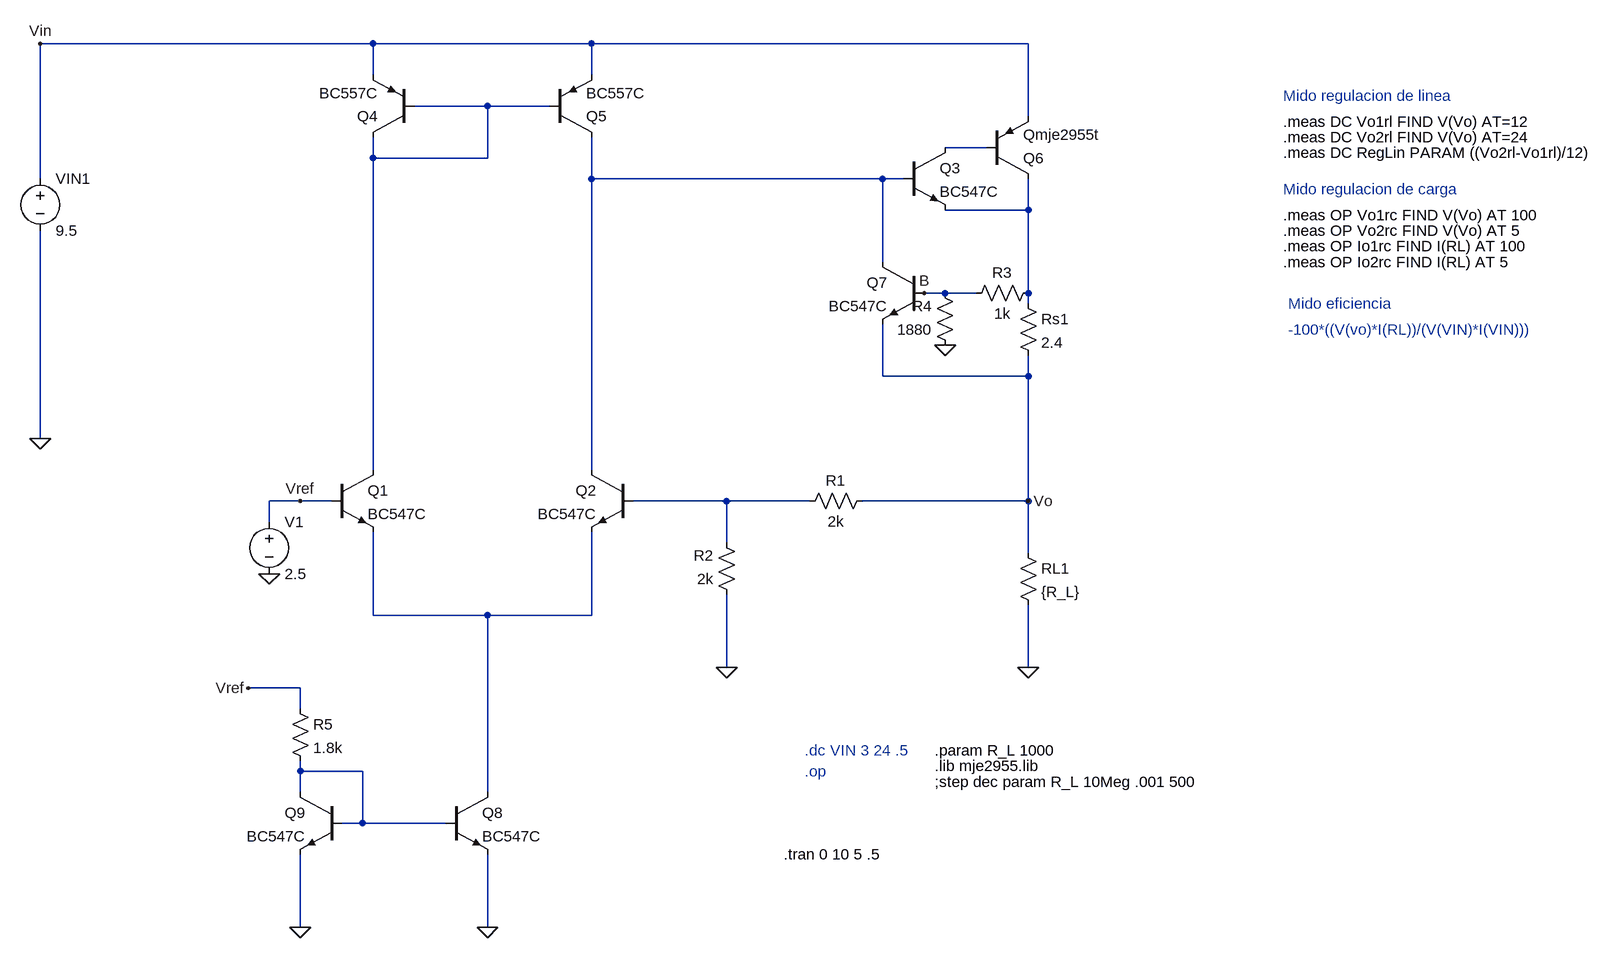
[diagram p0: schematic segundo_check_1.asc]
segundo_check_1.asc, the LTspice schematic file:
Version 4.1
SHEET 1 1564 820
WIRE -352 -560 -864 -560
WIRE -16 -560 -352 -560
WIRE 656 -560 -16 -560
WIRE -352 -512 -352 -560
WIRE -16 -512 -16 -560
WIRE -176 -464 -288 -464
WIRE -80 -464 -176 -464
WIRE 656 -448 656 -560
WIRE 592 -400 528 -400
WIRE -352 -384 -352 -416
WIRE -176 -384 -176 -464
WIRE -176 -384 -352 -384
WIRE -864 -352 -864 -560
WIRE -16 -352 -16 -416
WIRE 432 -352 -16 -352
WIRE 464 -352 432 -352
WIRE 656 -304 656 -352
WIRE 656 -304 528 -304
WIRE 432 -224 432 -352
WIRE 528 -176 496 -176
WIRE 576 -176 528 -176
WIRE 656 -176 656 -304
WIRE 656 -160 656 -176
WIRE 432 -48 432 -128
WIRE 656 -48 656 -80
WIRE 656 -48 432 -48
WIRE -864 48 -864 -272
WIRE -352 96 -352 -384
WIRE -16 96 -16 -352
WIRE -464 144 -512 144
WIRE -416 144 -464 144
WIRE 192 144 48 144
WIRE 320 144 192 144
WIRE 656 144 656 -48
WIRE 656 144 400 144
WIRE -512 176 -512 144
WIRE 192 208 192 144
WIRE 656 224 656 144
WIRE -352 320 -352 192
WIRE -176 320 -352 320
WIRE -16 320 -16 192
WIRE -16 320 -176 320
WIRE 192 400 192 288
WIRE 656 400 656 304
WIRE -464 432 -544 432
WIRE -464 464 -464 432
WIRE -464 560 -464 544
WIRE -368 560 -464 560
WIRE -464 592 -464 560
WIRE -176 592 -176 320
WIRE -368 640 -368 560
WIRE -368 640 -400 640
WIRE -240 640 -368 640
WIRE -464 800 -464 688
WIRE -176 800 -176 688
FLAG -512 256 0
FLAG 656 400 0
FLAG -864 48 0
FLAG 192 400 0
FLAG 656 144 Vo
FLAG 528 -96 0
FLAG 496 -176 B
FLAG -464 144 Vref
FLAG -176 800 0
FLAG -864 -560 Vin
FLAG -464 800 0
FLAG -544 432 Vref
SYMBOL npn -416 96 R0
SYMATTR InstName Q1
SYMATTR Value BC547C
SYMBOL npn 48 96 M0
SYMATTR InstName Q2
SYMATTR Value BC547C
SYMBOL npn 464 -400 R0
SYMATTR InstName Q3
SYMATTR Value BC547C
SYMBOL pnp -288 -416 R180
SYMATTR InstName Q4
SYMATTR Value BC557C
SYMBOL pnp -80 -416 M180
SYMATTR InstName Q5
SYMATTR Value BC557C
SYMBOL voltage -512 160 R0
WINDOW 123 0 0 Left 0
WINDOW 39 0 0 Left 0
SYMATTR InstName V1
SYMATTR Value 2.5
SYMBOL voltage -864 -368 R0
WINDOW 123 0 0 Left 0
WINDOW 39 0 0 Left 0
SYMATTR InstName VIN1
SYMATTR Value 9.5
SYMBOL pnp 592 -352 M180
SYMATTR InstName Q6
SYMATTR Value Qmje2955t
SYMBOL res 640 208 R0
SYMATTR InstName RL1
SYMATTR Value {R_L}
SYMBOL res 416 128 R90
WINDOW 0 0 56 VBottom 2
WINDOW 3 32 56 VTop 2
SYMATTR InstName R1
SYMATTR Value 2k
SYMBOL res 208 304 R180
WINDOW 0 36 76 Left 2
WINDOW 3 36 40 Left 2
SYMATTR InstName R2
SYMATTR Value 2k
SYMBOL npn 496 -224 M0
SYMATTR InstName Q7
SYMATTR Value BC547C
SYMBOL res 640 -176 R0
SYMATTR InstName Rs1
SYMATTR Value 2.4
SYMBOL res 672 -192 R90
WINDOW 0 0 56 VBottom 2
WINDOW 3 32 56 VTop 2
SYMATTR InstName R3
SYMATTR Value 1k
SYMBOL res 544 -80 R180
WINDOW 0 36 76 Left 2
WINDOW 3 36 40 Left 2
SYMATTR InstName R4
SYMATTR Value 1880
SYMBOL npn -240 592 R0
SYMATTR InstName Q8
SYMATTR Value BC547C
SYMBOL npn -400 592 M0
SYMATTR InstName Q9
SYMATTR Value BC547C
SYMBOL res -480 448 R0
SYMATTR InstName R5
SYMATTR Value 1.8k
TEXT 512 528 Left 2 !.param R_L 1000
TEXT 512 552 Left 2 !.lib mje2955.lib
TEXT 312 528 Left 2 ;.dc VIN 3 24 .5
TEXT 512 576 Left 2 !;step dec param R_L 10Meg .001 500
TEXT 312 560 Left 2 ;.op
TEXT 1048 -480 Left 2 ;Mido regulacion de linea
TEXT 1048 -440 Left 2 !.meas DC Vo1rl FIND V(Vo) AT=12
TEXT 1048 -416 Left 2 !.meas DC Vo2rl FIND V(Vo) AT=24
TEXT 1048 -392 Left 2 !.meas DC RegLin PARAM ((Vo2rl-Vo1rl)/12)
TEXT 1048 -336 Left 2 ;Mido regulacion de carga
TEXT 1048 -296 Left 2 !.meas OP Vo1rc FIND V(Vo) AT 100
TEXT 1048 -272 Left 2 !.meas OP Vo2rc FIND V(Vo) AT 5
TEXT 1048 -248 Left 2 !.meas OP Io1rc FIND I(RL) AT 100
TEXT 1048 -224 Left 2 !.meas OP Io2rc FIND I(RL) AT 5
TEXT 1056 -160 Left 2 ;Mido eficiencia
TEXT 1056 -120 Left 2 ;-100*((V(vo)*I(RL))/(V(VIN)*I(VIN)))
TEXT 280 688 Left 2 !.tran 0 10 5 .5

The netlist it stands for:
* segundo_check_1.asc
Q1 N001 Vref N006 0 BC547C
Q2 N003 N005 N006 0 BC547C
Q3 N002 N003 N004 0 BC547C
Q4 N001 N001 Vin 0 BC557C
Q5 N003 N001 Vin 0 BC557C
V1 Vref 0 2.5
VIN1 Vin 0 9.5
Q6 N004 N002 Vin 0 Qmje2955t
RL1 Vo 0 {R_L}
R1 Vo N005 2k
R2 0 N005 2k
Q7 N003 B Vo 0 BC547C
Rs1 N004 Vo 2.4
R3 N004 B 1k
R4 0 B 1880
Q8 N006 N007 0 0 BC547C
Q9 N007 N007 0 0 BC547C
R5 Vref N007 1.8k
.model NPN NPN
.model PNP PNP
.lib standard.bjt
.param R_L 1000
.lib mje2955.lib
* .dc VIN 3 24 .5
;step dec param R_L 10Meg .001 500
* .op
* Mido regulacion de linea
.meas DC Vo1rl FIND V(Vo) AT=12
.meas DC Vo2rl FIND V(Vo) AT=24
.meas DC RegLin PARAM ((Vo2rl-Vo1rl)/12)
* Mido regulacion de carga
.meas OP Vo1rc FIND V(Vo) AT 100
.meas OP Vo2rc FIND V(Vo) AT 5
.meas OP Io1rc FIND I(RL) AT 100
.meas OP Io2rc FIND I(RL) AT 5
* Mido eficiencia
* -100*((V(vo)*I(RL))/(V(VIN)*I(VIN)))
.tran 0 10 5 .5
.backanno
.end